# EAGLE schematic CircuitoControle (EAGLE 9.1.0)
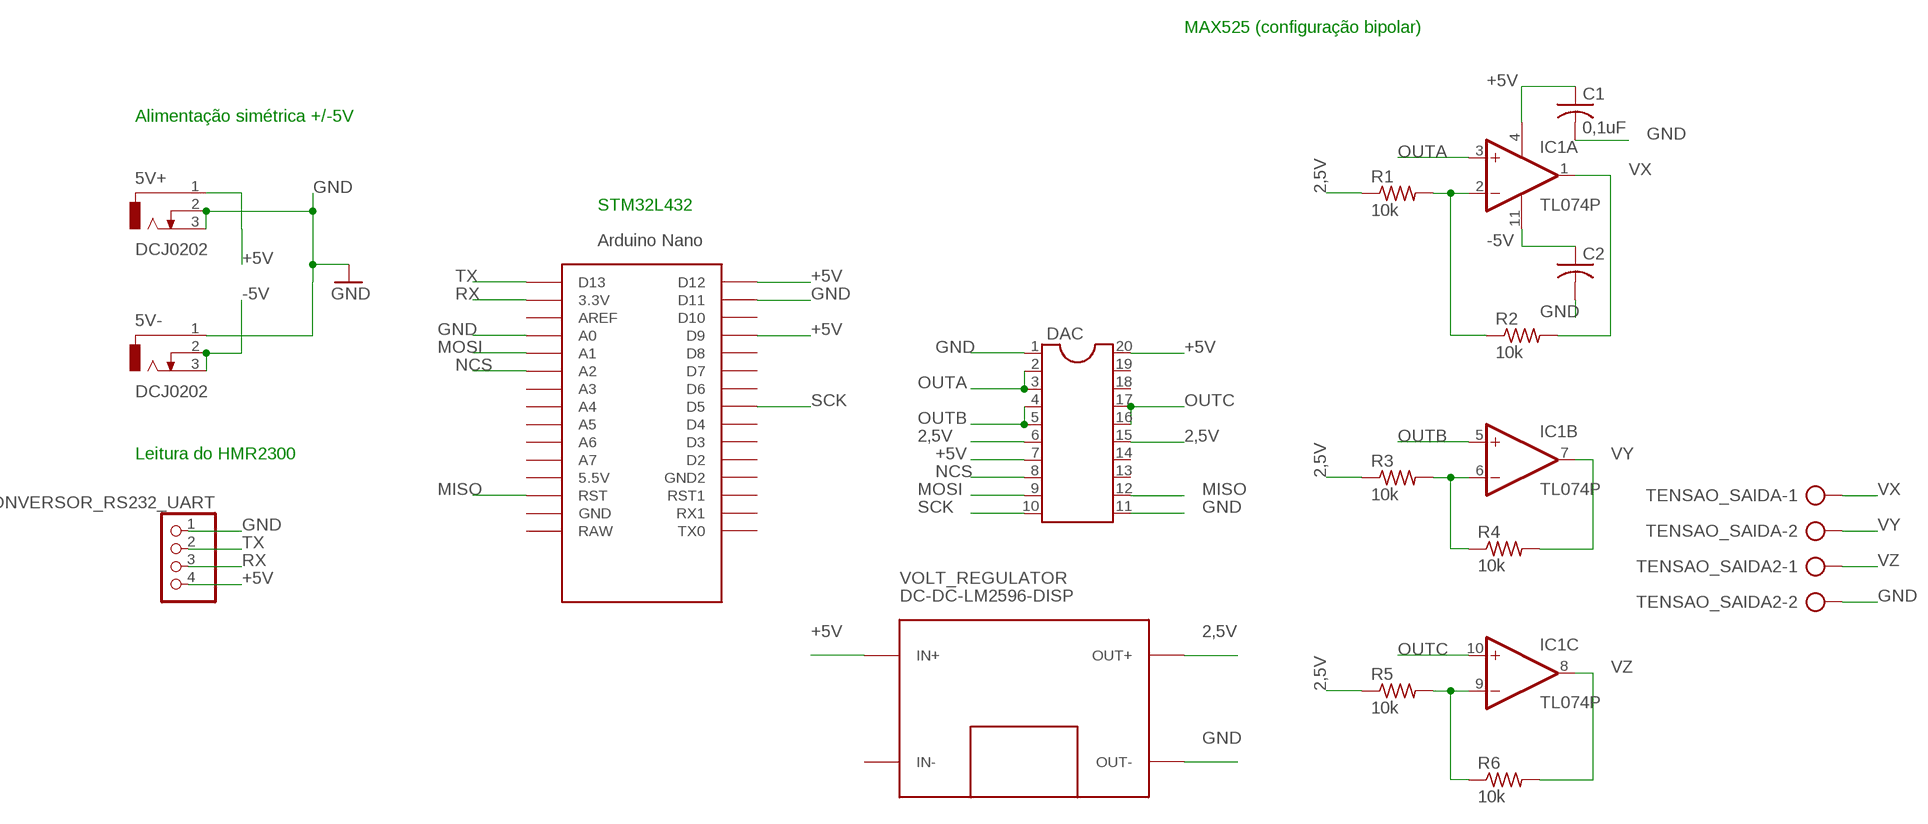
[diagram p0: schematic, sheet 1]

## Parts
5V+  DCJ0202  [DCJ0202]
5V-  DCJ0202  [DCJ0202]
C1  0,1uF  C-US025-024X044  [C025-024X044]
C2  C-US025-024X044  [C025-024X044]
CONVERSOR_RS232_UART  PINHD-1X4  [1X04]
DAC  DIL20  [DIL20]
IC1  TL074P  [DIL14]
R1  10k  R-US_0204/5  [0204/5]
R2  10k  R-US_0204/5  [0204/5]
R3  10k  R-US_0204/5  [0204/5]
R4  10k  R-US_0204/5  [0204/5]
R5  10k  R-US_0204/5  [0204/5]
R6  10k  R-US_0204/5  [0204/5]
STM32  NANO  [NANO]
TENSAO_SAIDA  AK500/2-H  [AK500/2-H]
TENSAO_SAIDA2  AK500/2-H  [AK500/2-H]
VOLT_REGULATOR  DC-DC-LM2596-DISP  [DC-DC-LM2596-DISP]

## Nets
2,5V: DAC.6 DAC.15 R1.1 R3.1 R5.1 VOLT_REGULATOR.OUT+
+5V: 5V+.1 C1.1 CONVERSOR_RS232_UART.4 DAC.7 DAC.20 IC1.4(P:V+) STM32.D9 STM32.D12 VOLT_REGULATOR.IN+
-5V: 5V-.2 5V-.3 C2.1 IC1.11(P:V-)
GND: 5V+.2 5V+.3 5V-.1 C1.2 C2.2 CONVERSOR_RS232_UART.1 DAC.1 DAC.11 STM32.A0 STM32.D11 TENSAO_SAIDA2.2 VOLT_REGULATOR.OUT-
MISO: DAC.12 STM32.RST
MOSI: DAC.9 STM32.A1
N$1: IC1.6(B:-IN) R3.2 R4.1
N$2: IC1.2(A:-IN) R1.2 R2.1
N$4: IC1.9(C:-IN) R5.2 R6.1
NCS: DAC.8 STM32.A2
OUTA: DAC.2 DAC.3 IC1.3(A:+IN)
OUTB: DAC.4 DAC.5 IC1.5(B:+IN)
OUTC: DAC.16 DAC.17 IC1.10(C:+IN)
RX: CONVERSOR_RS232_UART.3 STM32.3.3V
SCK: DAC.10 STM32.D5
TX: CONVERSOR_RS232_UART.2 STM32.D13
VX: IC1.1(A:OUT) R2.2 TENSAO_SAIDA.1
VY: IC1.7(B:OUT) R4.2 TENSAO_SAIDA.2
VZ: IC1.8(C:OUT) R6.2 TENSAO_SAIDA2.1
Unconnected: DAC.13 DAC.14 DAC.18 DAC.19 IC1.12(D:+IN) IC1.13(D:-IN) IC1.14(D:OUT) STM32.5V(5.5V) STM32.A3 STM32.A4 STM32.A5 STM32.A6 STM32.A7 STM32.AREF STM32.D2 STM32.D3 STM32.D4 STM32.D6 STM32.D7 STM32.D8 STM32.D10 STM32.GND STM32.GND1(GND2) STM32.ICSP1 STM32.ICSP2 STM32.ICSP3 STM32.ICSP4 STM32.ICSP5 STM32.ICSP6 STM32.RAW STM32.RST1 STM32.RX1 STM32.TX0 VOLT_REGULATOR.IN-

## Notes on the sheet
- MAX525 (configuração bipolar)
- Alimentação simétrica +/-5V
- STM32L432
- Leitura do HMR2300

## Library data of the parts
5V+ 5V- = con-jack:DCJ0202: DC POWER JACK Source: DCJ0202.pdf; OC_FARNELL: unknown; OC_NEWARK: unknown
C1 C2 = resistor:C-US: CAPACITOR, American symbol
CONVERSOR_RS232_UART = pinhead:PINHD-1X4: PIN HEADER
DAC = ic-package:DIL20: Dual In Line / Socket
IC1 = linear3:TL074: OP AMP
R1-R6 = rcl:R-US_: RESISTOR, American symbol; SPICEPREFIX: R
STM32 = Arduino-clone:NANO: Arduino Nano
TENSAO_SAIDA TENSAO_SAIDA2 = con-ptr500:AK500/2-H: CONNECTOR Aug. 2004 / PTR Meßtechnik: Die Bezeichnung der Serie AK505 wurde geändert. Es handelt sich hierbei um AK500 in horizontaler Ausführung.; OC_FARNELL: unknown; OC_NEWARK: unknown
VOLT_REGULATOR = diy-modules:DC-DC-LM2596-DISP: DC/DC Step-Down Regulator with Voltage Display based on LM2596-ADJ chip